# Altium schematic sheet Output Sensors.SchDoc
size A
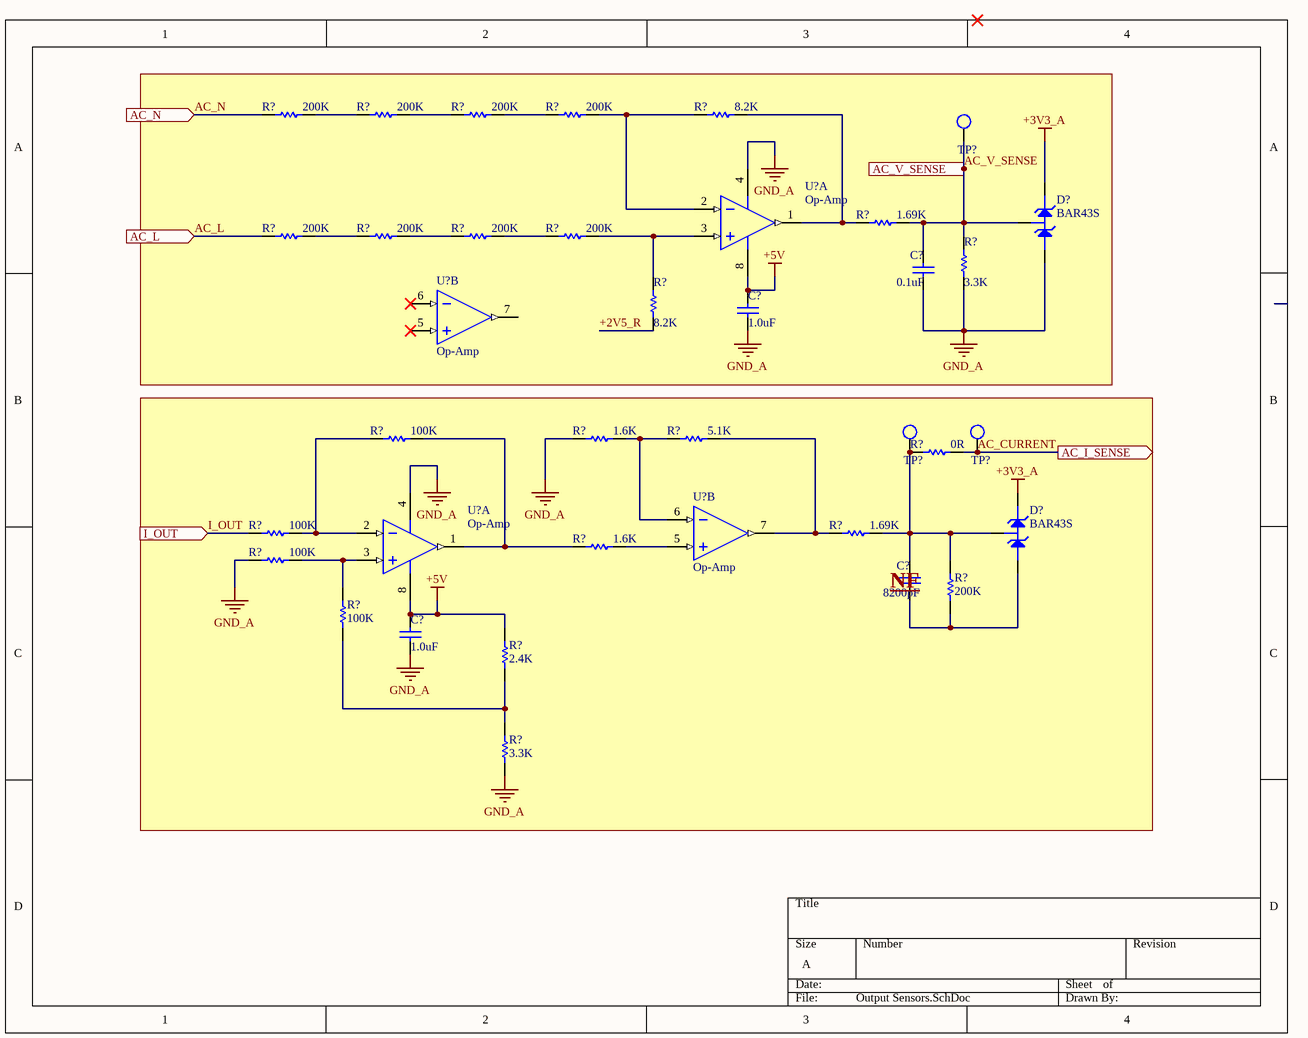
[diagram p0: Output Sensors.SchDoc]

## Parts
(Parts that share a designator on the sheet are numbered #1, #2 ... from top to bottom, then left to right.)
C?#1  0.1uF  [1206 CAPACITOR]
C?#2  1.0uF  [1206 CAPACITOR]
C?#3  8200pF  [1206 CAPACITOR]
C?#4  1.0uF  [1206 CAPACITOR]
D?#1  BAR43S  [SOT23-3]
D?#2  BAR43S  [SOT23-3]
R?#1  200K  [1206 Resistor Footprint]
R?#2  200K  [1206 Resistor Footprint]
R?#3  200K  [1206 Resistor Footprint]
R?#4  200K  [1206 Resistor Footprint]
R?#5  8.2K  [1206 Resistor Footprint]
R?#6  1.69K  [1206 Resistor Footprint]
R?#7  200K  [1206 Resistor Footprint]
R?#8  200K  [1206 Resistor Footprint]
R?#9  200K  [1206 Resistor Footprint]
R?#10  200K  [1206 Resistor Footprint]
R?#11  3.3K  [1206 Resistor Footprint]
R?#12  8.2K  [1206 Resistor Footprint]
R?#13  100K  [1206 Resistor Footprint]
R?#14  1.6K  [1206 Resistor Footprint]
R?#15  5.1K  [1206 Resistor Footprint]
R?#16  0R  [1206 Resistor Footprint]
R?#17  100K  [1206 Resistor Footprint]
R?#18  1.69K  [1206 Resistor Footprint]
R?#19  1.6K  [1206 Resistor Footprint]
R?#20  100K  [1206 Resistor Footprint]
R?#21  200K  [1206 Resistor Footprint]
R?#22  100K  [1206 Resistor Footprint]
R?#23  2.4K  [1206 Resistor Footprint]
R?#24  3.3K  [1206 Resistor Footprint]
TP?#1  Test Point  [Test Point]  (value not drawn)
TP?#2  Test Point  [Test Point]  (value not drawn)
TP?#3  Test Point  [Test Point]  (value not drawn)
U?#1  Op-Amp  [SOIC-SN8_M]  (part A of 2)
U?#2  Op-Amp  [SOIC-SN8_M]  (part B of 2)
U?#3  Op-Amp  [SOIC-SN8_M]  (part B of 2)
U?#4  Op-Amp  [SOIC-SN8_M]  (part A of 2)

## Blocks framed on the sheet
NF: C?#3 C?#4 D?#2 R?#13-R?#24 TP?#2 TP?#3 U?#3 U?#4

## Ports
AC_I_SENSE (out), AC_L (in), AC_N (in), AC_V_SENSE (out), I_OUT (in)

## Nets
+3V3_A: D?#1.2 D?#2.2
+5V: C?#2.2 C?#4.2 R?#23.2 U?#1.8 U?#4.8
GND_A: C?#1.1 C?#2.1 C?#4.1 D?#1.1 R?#11.1 R?#14.1 R?#20.1 R?#24.1 U?#1.4 U?#4.4
+2V5_R: R?#12.1
AC_CURRENT: R?#16.2 TP?#3.1 ; port AC_I_SENSE
AC_L: R?#7.1 ; port AC_L
AC_N: R?#1.1 ; port AC_N
AC_V_SENSE: C?#1.2 D?#1.3 R?#6.2 R?#11.2 TP?#1.1 ; port AC_V_SENSE
I_OUT: R?#17.1 ; port I_OUT
NetC?#3_1: C?#3.1 D?#2.1 R?#21.1
NetC?#3_2: C?#3.2 D?#2.3 R?#16.1 R?#18.2 R?#21.2 TP?#2.1
NetR?#1_2: R?#1.2 R?#2.1
NetR?#2_2: R?#2.2 R?#3.1
NetR?#3_2: R?#3.2 R?#4.1
NetR?#4_2: R?#4.2 R?#5.1 U?#1.2(VINA-)
NetR?#5_2: R?#5.2 R?#6.1 U?#1.1(VOUTA)
NetR?#7_2: R?#7.2 R?#8.1
NetR?#8_2: R?#8.2 R?#9.1
NetR?#9_2: R?#9.2 R?#10.1
NetR?#10_2: R?#10.2 R?#12.2 U?#1.3(VINA+)
NetR?#13_1: R?#13.1 R?#17.2 U?#4.2(VINA-)
NetR?#13_2: R?#13.2 R?#19.1 U?#4.1(VOUTA)
NetR?#14_2: R?#14.2 R?#15.1 U?#3.6(VINB-)
NetR?#15_2: R?#15.2 R?#18.1 U?#3.7(VOUTB)
NetR?#19_2: R?#19.2 U?#3.5(VINB+)
NetR?#20_2: R?#20.2 R?#22.2 U?#4.3(VINA+)
NetR?#22_1: R?#22.1 R?#23.1 R?#24.2

Not connected (* = marked no-connect by the designer): U?#2 5(VINB+)* 6(VINB-)* 7(VOUTB)

## Library data of the parts
C?#1-C?#4 = Capacitor Non-Polorized: Value: 10uF; Case-EIA: 1206; Tolerance: -20% to +80%; Rated Voltage: 25 V; Case-Metric: 3216; Max Thickness: 1.9 mm; Technology: SMT
D?#1 D?#2 = Schottky Rectifier
R?#1-R?#24 = Resistor
U?#1-U?#4 = Op-Amp: PackageDescription: 8-Lead Plastic Small Outline (SN) - Narrow, 3.90mm Body [SOIC]; ComponentLink2Description: Datasheet; ComponentLink3Description: Package Specification; Code_JEDEC: MS-012; RevisionNote: URLs added.; DatasheetVersion: revD, Feb-2009; Code_IPC: SOIC127P600-8; ComponentLink3URL: http://www.microchip.com/stellent/groups/techpub_sg/documents/packagingspec/en012702.pdf; PackageReference: SOIC-SN8; PackageVersion: revBB, Aug-2009; ComponentLink2URL: http://ww1.microchip.com/downloads/en/DeviceDoc/21685d.pdf; ComponentLink1URL: http://www.microchip.com/; ComponentLink1Description: Manufacturer URL